# EAGLE design ArduBoard (EAGLE 6.1)
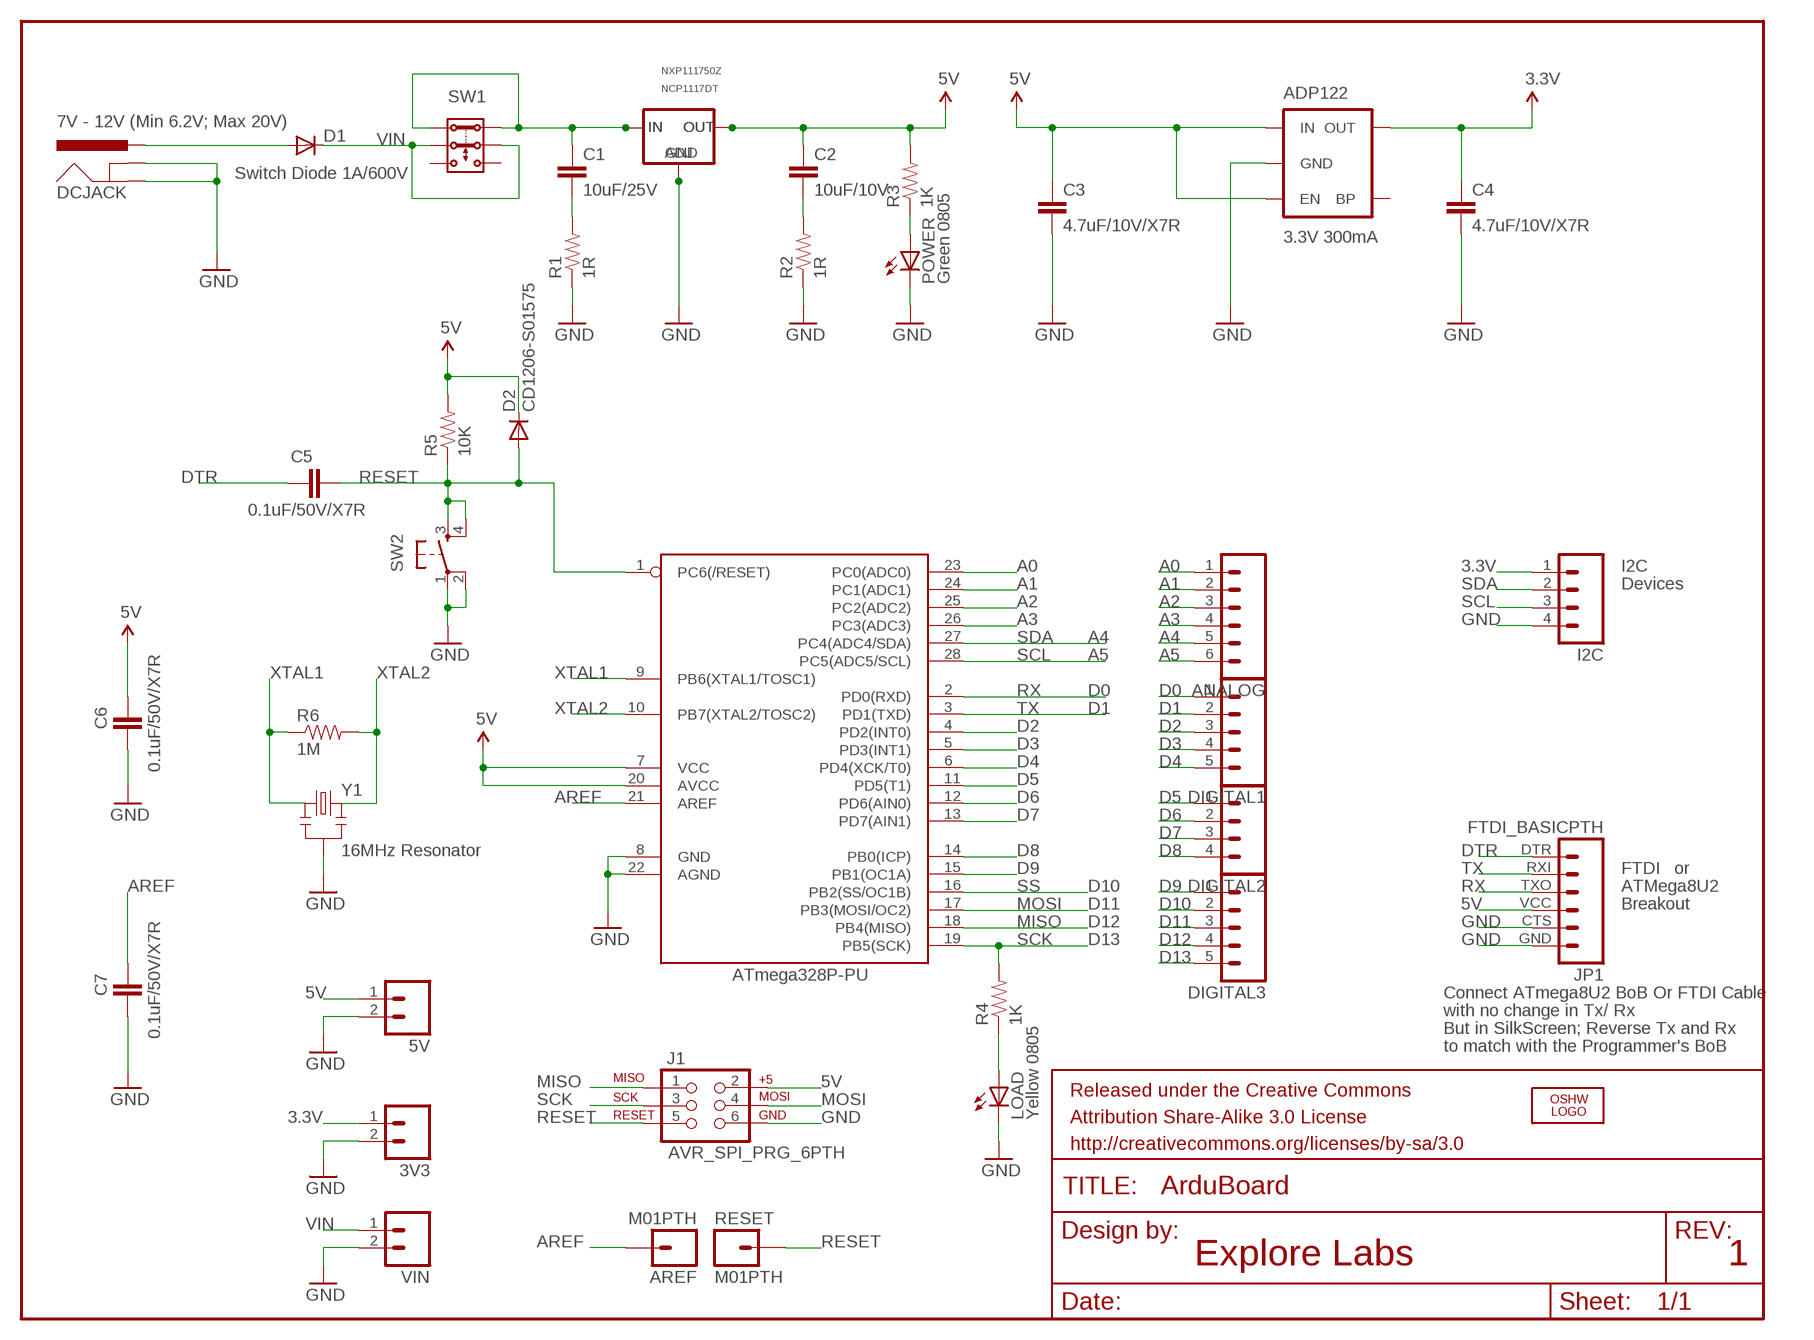
[diagram p0: schematic, sheet 1]

## Parts
3V3  M02PTH  [1X02]
5V  M02PTH  [1X02]
ADP122  3.3V 300mA  V_REG_LDOSMD  [SOT23-5]
ANALOG  M06SIP  [1X06]
AREF  M01PTH  [1X01]
ATMEGA328P-PU  AVR-MEGA8-PPTH  [DIL28-3]
C1  10uF/25V  CAP1206  [1206]
C2  10uF/10V  CAP1206  [1206]
C3  4.7uF/10V/X7R  CAP0805  [0805]
C4  4.7uF/10V/X7R  CAP0805  [0805]
C5  0.1uF/50V/X7R  CAP0805  [0805]
C6  0.1uF/50V/X7R  CAP0805  [0805]
C7  0.1uF/50V/X7R  CAP0805  [0805]
D1  Switch Diode 1A/600V  DIODE-DO-214AC  [DO-214AC]
D2  CD1206-S01575  DIODE-MINIMELF  [MINIMELF]
DCJACK  POWER_JACKPTH  [POWER_JACK_PTH]
DIGITAL1  M05PTH  [1X05]
DIGITAL2  M04PTH  [1X04]
DIGITAL3  M05PTH  [1X05]
I2C  M04PTH  [1X04]
IC1  V_REG_MIC2920NXPNX1117C50Z  [SOT223]
J1  AVR_SPI_PRG_6PTH  [2X3]
JP1  FTDI_BASICPTH  [FTDI_BASIC]
LOAD  Yellow 0805  LEDCHIP-LED0805  [CHIP-LED0805]
LOGO1  OSHW_LOGO_FILLX0150-NT  [OSHW_FILLX150_NOTEXT]
POWER  Green 0805  LEDCHIPLED_0805  [CHIPLED_0805]
R1  1R  RESISTOR0603-RES  [0603-RES]
R2  1R  RESISTOR0603-RES  [0603-RES]
R3  1K  RESISTOR0603-RES  [0603-RES]
R4  1K  RESISTOR0603-RES  [0603-RES]
R5  10K  RESISTOR0603-RES  [0603-RES]
R6  1M  RESISTOR0805-RES  [0805]
RESET  M01PTH  [1X01]
SW1  DPDTELEMENT14  [MS]
SW2  TAC_SWITCHPTH  [TACTILE-PTH]
U1  V_REG_317DPACK  [V-REG_DPACK]
VIN  M02PTH  [1X02]
Y1  16MHz Resonator  RESONATORSMD  [RESONATOR-SMD]

## Nets
3.3V: 3V3.1 ADP122.5(OUT) C4.1 I2C.1
5V [5v]: 5V.1 ADP122.1(IN) ADP122.3(EN) ATMEGA328P-PU.7(VCC) ATMEGA328P-PU.20(AVCC) C2.1 C3.1 C6.2 D2.C IC1.4(OUT) J1.2 JP1.VCC R3.2 R5.2 U1.4(OUT)
A0: ANALOG.1 ATMEGA328P-PU.23(PC0(ADC0))
A1: ANALOG.2 ATMEGA328P-PU.24(PC1(ADC1))
A2: ANALOG.3 ATMEGA328P-PU.25(PC2(ADC2))
A3: ANALOG.4 ATMEGA328P-PU.26(PC3(ADC3))
AREF: AREF.1 ATMEGA328P-PU.21(AREF) C7.2
D2: ATMEGA328P-PU.4(PD2(INT0)) DIGITAL1.3
D3: ATMEGA328P-PU.5(PD3(INT1)) DIGITAL1.4
D4: ATMEGA328P-PU.6(PD4(XCK/T0)) DIGITAL1.5
D5: ATMEGA328P-PU.11(PD5(T1)) DIGITAL2.1
D6: ATMEGA328P-PU.12(PD6(AIN0)) DIGITAL2.2
D7: ATMEGA328P-PU.13(PD7(AIN1)) DIGITAL2.3
D8: ATMEGA328P-PU.14(PB0(ICP)) DIGITAL2.4
D9: ATMEGA328P-PU.15(PB1(OC1A)) DIGITAL3.1
DTR: C5.1 JP1.DTR
GND [gnd]: 3V3.2 5V.2 ADP122.2(GND) ATMEGA328P-PU.8(GND) ATMEGA328P-PU.22(AGND) C3.2 C4.2 C6.1 C7.1 DCJACK.GND DCJACK.GNDBREAK I2C.4 IC1.1(GND) J1.6 JP1.CTS JP1.GND LOAD.C POWER.C R1.1 R2.1 SW2.1 SW2.2 U1.1(ADJ) VIN.2 Y1.2
MISO: ATMEGA328P-PU.18(PB4(MISO)) DIGITAL3.4 J1.1
MOSI: ATMEGA328P-PU.17(PB3(MOSI/OC2)) DIGITAL3.3 J1.4
N$1: C1.2 R1.2
N$2: C1.1 IC1.3(IN) SW1.P$1(1.2) SW1.P$2(1.1) U1.3(IN)
N$3: C2.2 R2.2
N$4: POWER.A R3.1
N$5: LOAD.A R4.1
N$6: D1.A DCJACK.PWR
RESET: ATMEGA328P-PU.1(PC6(/RESET)) C5.2 D2.A J1.5 R5.1 RESET.1 SW2.3 SW2.4
RX: ATMEGA328P-PU.2(PD0(RXD)) DIGITAL1.1 JP1.TXO
SCK: ATMEGA328P-PU.19(PB5(SCK)) DIGITAL3.5 J1.3 R4.2
SCL: ANALOG.6 ATMEGA328P-PU.28(PC5(ADC5/SCL)) I2C.3
SDA: ANALOG.5 ATMEGA328P-PU.27(PC4(ADC4/SDA)) I2C.2
SS: ATMEGA328P-PU.16(PB2(SS/OC1B)) DIGITAL3.2
TX: ATMEGA328P-PU.3(PD1(TXD)) DIGITAL1.2 JP1.RXI
VIN: D1.C SW1.P$3(2.1) SW1.P$4(2.2) VIN.1
XTAL1: ATMEGA328P-PU.9(PB6(XTAL1/TOSC1)) R6.1 Y1.1
XTAL2: ATMEGA328P-PU.10(PB7(XTAL2/TOSC2)) R6.2 Y1.3
Unconnected: ADP122.4(BP) SW1.P$5(3.1) SW1.P$6(3.2)

## Notes on the sheet
- NXP111750Z
- NCP1117DT
- 7V - 12V (Min 6.2V; Max 20V)
- I2C
- Devices
- A4 | A4
- A5 | A5
- D0 | D0
- D1 | D1
- FTDI | or
- D10 | ATMega8U2
- D11 | D10 | Breakout
- D12 | D11
- D13 | D12
- D13
- ATmega328P-PU
- Connect ATmega8U2 BoB Or FTDI Cable
- with no change in Tx/ Rx
- But in SilkScreen; Reverse Tx and Rx
- to match with the Programmer's BoB
- Explore Labs | 1

## Library data of the parts
3V3 5V VIN = SparkFun - copy Connectors:M02: Header 2 Standard 2-pin 0.1" header. Use with straight break away headers (SKU : PRT-00116), right angle break away headers (PRT-00553), swiss pins (PRT-00743), machine pins (PRT-00117), and female headers (PRT-00115). Molex polarized connector foot print use with SKU : PRT-08233 with associated crimp pins and housings.
ADP122 = SparkFun-PowerIC:V_REG_LDO: Voltage Regulator LDO Standard 150mA LDO voltage regulator in SOT-23 layout. Micrel part MIC5205. BP (by-pass) pin is used to lower output noise with 470pF cap.
ANALOG = SparkFun-Connectors:M06: Header 6 Standard 6-pin 0.1" header. Use with straight break away headers (SKU : PRT-00116), right angle break away headers (PRT-00553), swiss pins (PRT-00743), machine pins (PRT-00117), and female headers (PRT-00115). Molex polarized connector foot print use with SKU : PRT-08094 with associated crimp pins and housings. NOTES ON THE VARIANTS LOCK and LOCK_LONGPADS... This footprint was designed to help hold the alignment of a through-hole component (i.e. 6-pin header) while soldering it into place. You may notice that each hole has been shifted either up or down by 0.005 of an inch from it's more standard position (which is a perfectly straight line). This slight alteration caused the pins (the squares in the middle) to touch the edges of the holes. Because they are alternating, it causes a "brace" to hold the component in place. 0.005 has proven to be the perfect amount of "off-center" position when using our standard breakaway headers. Although looks a little odd when you look at the bare footprint, once you have a header in there, the alteration is very hard to notice. Also, if you push a header all the way into place, it is covered up entirely on the bottom side. This idea of altering the position of holes to aid alignment will be further integrated into the Sparkfun Library for other footprints. It can help hold any component with 3 or more connection pins.
AREF RESET = SparkFun-Connectors:M01: Header 1 Standard 1-pin 0.1" header. Use with straight break away headers (SKU : PRT-00116), right angle break away headers (PRT-00553), swiss pins (PRT-00743), machine pins (PRT-00117), and female headers (PRT-00115).
ATMEGA328P-PU = SparkFun-DigitalIC:AVR-MEGA8-P: MICROCONTROLLER 8 Kbytes FLASH 1 kbytes SRAM 512 bytes EEPROM USART 4-channel 10 bit ADC 2-channel 8 bit ADC
C1-C7 = SparkFun-Passives:CAP: Capacitor Standard 0603 ceramic capacitor, and 0.1" leaded capacitor.
D1 D2 = diode:DIODE-: DIODE
DCJACK = SparkFun-Connectors:POWER_JACK: Power Jack This is the standard 5.5mm barrel jack for power. The PTH is the most common, proven, reliable, footprint. All others are experimental. The Slot footprint only works if the mill layer is transmitted to the PCB fab house so be warned. Spark Fun Electronics SKU : PRT-00119. Mating wall wart : TOL-00298 (and others)
DIGITAL1 DIGITAL3 = SparkFun-Connectors:M05: Header 5 Standard 5-pin 0.1" header. Use with straight break away headers (SKU : PRT-00116), right angle break away headers (PRT-00553), swiss pins (PRT-00743), machine pins (PRT-00117), and female headers (PRT-00115). Molex polarized connector foot print use with SKU : PRT-08230 with associated crimp pins and housings.
DIGITAL2 = SparkFun - copy Connectors:M04: Header 4 Standard 4-pin 0.1" header. Use with straight break away headers (SKU : PRT-00116), right angle break away headers (PRT-00553), swiss pins (PRT-00743), machine pins (PRT-00117), and female headers (PRT-00115). Molex polarized connector foot print use with SKU : PRT-08231 with associated crimp pins and housings. 1MM SMD Version SKU: PRT-10208
I2C = SparkFun-Connectors:M04: Header 4 Standard 4-pin 0.1" header. Use with straight break away headers (SKU : PRT-00116), right angle break away headers (PRT-00553), swiss pins (PRT-00743), machine pins (PRT-00117), and female headers (PRT-00115). Molex polarized connector foot print use with SKU : PRT-08231 with associated crimp pins and housings. 1MM SMD Version SKU: PRT-10208
IC1 = copy:V_REG_MIC2920: NXP's NX1117C50Z 5V LDO 800mA 1% SOT223 Pins 2 and 4 are Output Pins. Pin 2 should be left connected to the Pad only. Pin 4 will provide Thermal Dissipation as well as Output to the rest of the Circuit. Datasheet - http://www.nxp.com/documents/data_sheet/NX1117C_NX1117CE_SER.pdf; NXP: NX1117C50Z
J1 = SparkFun-Connectors:AVR_SPI_PRG_6: AVR ISP 6 Pin This is the reduced ISP connector for AVR programming. Common on Arduino. This footprint will take up less PCB space and can be used with a 10-pin to 6-pin adapter such as SKU: BOB-08508
JP1 = SparkFun-Connectors:FTDI_BASIC: FTDI Basic header with labels
LOAD POWER = led:LED: LED OSRAM: - CHIPLED LG R971, LG N971, LY N971, LG Q971, LY Q971, LO R971, LY R971 LH N974, LH R974 LS Q976, LO Q976, LY Q976 LO Q996 - Hyper CHIPLED LW Q18S LB Q993, LB Q99A, LB R99A - SideLED LS A670, LO A670, LY A670, LG A670, LP A670 LB A673, LV A673, LT A673, LW A673 LH A674 LY A675 LS A676, LA A676, LO A676, LY A676, LW A676 LS A679, LY A679, LG A679 - Hyper Micro SIDELED® LS Y876, LA Y876, LO Y876, LY Y876 LT Y87S - SmartLED LW L88C, LW L88S LB L89C, LB L89S, LG L890 LS L89K, LO L89K, LY L89K LS L896, LA L896, LO L896, LY L896 - TOPLED LS T670, LO T670, LY T670, LG T670, LP T670 LSG T670, LSP T670, LSY T670, LOP T670, LYG T670 LG T671, LOG T671, LSG T671 LB T673, LV T673, LT T673, LW T673 LH T674 LS T676, LA T676, LO T676, LY T676, LB T676, LH T676, LSB T676, LW T676 LB T67C, LV T67C, LT T67C, LS T67K, LO T67K, LY T67K, LW E67C LS E67B, LA E67B, LO E67B, LY E67B, LB E67C, LV E67C, LT E67C LW T67C LS T679, LY T679, LG T679 LS T770, LO T770, LY T770, LG T770, LP T770 LB T773, LV T773, LT T773, LW T773 LH T774 LS E675, LA E675, LY E675, LS T675 LS T776, LA T776, LO T776, LY T776, LB T776 LHGB T686 LT T68C, LB T68C - Hyper Mini TOPLED® LB M676 - Mini TOPLED Santana® LG M470 LS M47K, LO M47K, LY M47K Source: http://www.osram.convergy.de LUXEON: - LUMILED® LXK2-PW12-R00, LXK2-PW12-S00, LXK2-PW14-U00, LXK2-PW14-V00 LXK2-PM12-R00, LXK2-PM12-S00, LXK2-PM14-U00 LXK2-PE12-Q00, LXK2-PE12-R00, LXK2-PE12-S00, LXK2-PE14-T00, LXK2-PE14-U00 LXK2-PB12-K00, LXK2-PB12-L00, LXK2-PB12-M00, LXK2-PB14-N00, LXK2-PB14-P00, LXK2-PB14-Q00 LXK2-PR12-L00, LXK2-PR12-M00, LXK2-PR14-Q00, LXK2-PR14-R00 LXK2-PD12-Q00, LXK2-PD12-R00, LXK2-PD12-S00 LXK2-PH12-R00, LXK2-PH12-S00 LXK2-PL12-P00, LXK2-PL12-Q00, LXK2-PL12-R00 Source: www.luxeon.com KINGBRIGHT: KA-3528ASYC Source: www.kingbright.com
LOGO1 = ohw-logo:OSHW_LOGO_FILL
R1-R6 = SparkFun-Passives:RESISTOR: Resistor Basic schematic elements and footprints for 0603, 1206, and PTH resistors.
SW1 = SparkFun - copy switch:DPDT
SW2 = SparkFun-Electromechanical:TAC_SWITCH: Momentary Switch Button commonly used for reset or general input. Spark Fun Electronics SKU : COM-00097
U1 = SparkFun-PowerIC:V_REG_317: Voltage Regulator Standard LM317 adjustable voltage regulator. AOI (Adjust Output Input). Google 'LM317 Calculator' for easy to use app to get the two resistor values needed. 240/720 for 5V output. 240/390 for 3.3V output. Spark Fun Electronics SKU : COM-00527
Y1 = SparkFun-FreqCtrl:RESONATOR: Resonator Small SMD resonator. This is the itty bitty 10/20MHz resonators with built in caps. CSTCE10M0G55 and CSTCE20M0V53. Footprint has been reviewed closely but hasn't been tested yet.

## Net classes
0 default: width 0.254 mm, drill 0.61 mm, clearance 0.254 mm
1 5v: width 0.254 mm, drill 0.61 mm, clearance 0.254 mm
2 gnd: width 0.254 mm, drill 0.61 mm, clearance 0.254 mm

## Board
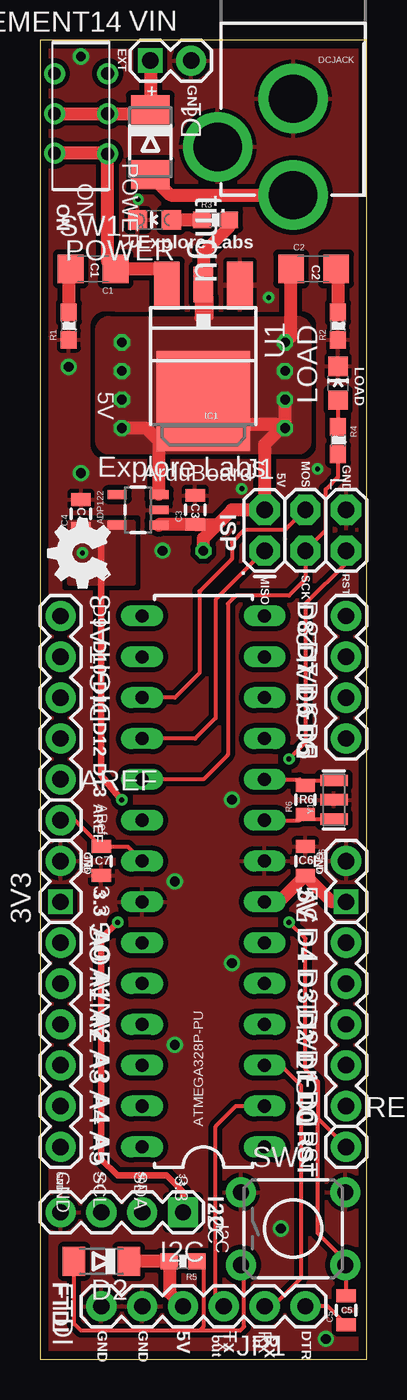
[diagram p1: board, top side]
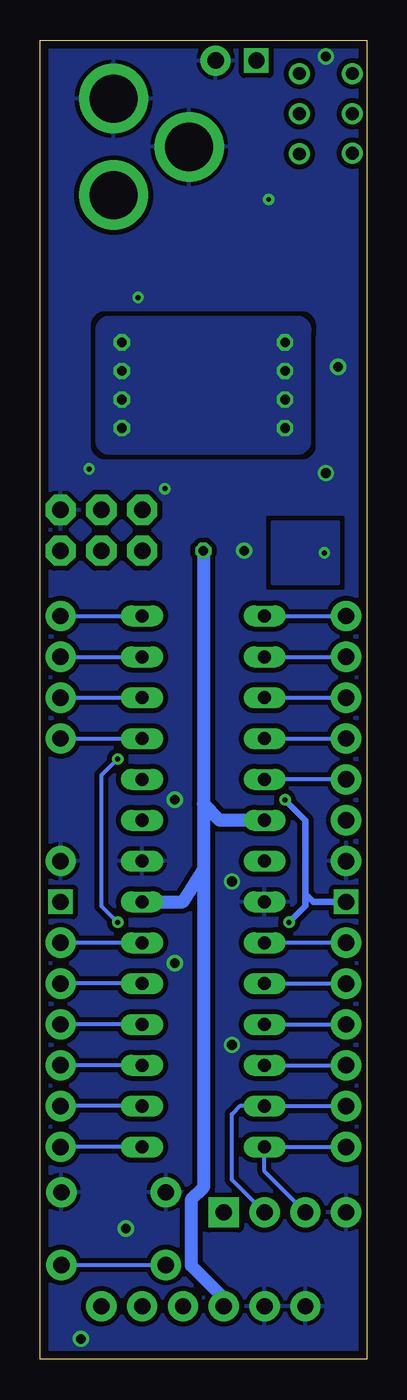
[diagram p2: board, bottom side, seen from below]

Size 20.32 x 82.04 mm. Coordinates in mm from the lower left corner, seen from the top.
Outline: 0,0 20.32,0 20.32,82.04 0,82.04 0,0
Copper layers (1*16): Top 0.035mm / dielectric 1.5mm / Bottom 0.035mm
Design rules: minimum track width 10mil, minimum drill 24mil, track to track 8mil, track to pad 8mil, pad to pad 8mil, via to via 8mil, smd to smd 8mil, copper to edge 20mil, drill to drill 8mil, minimum pad ring 10mil, minimum via ring 8mil, stop-mask expansion 4mil, vias tented up to drill 0mil, thermal gap 10mil

### Footprints (pad centres in the part's own frame; a part is rotated, then mirrored left to right if it is on the bottom)
1X02 = drill 1.016 pad 1.524 square: 1 0,0 | drill 1.016 pad 1.88: 2 2.54,0
SOT23-5 = smd 0.55 x 1.2: 1 -0.95,-1.3; 2 0,-1.3; 3 0.95,-1.3; 4 0.95,1.3; 5 -0.95,1.3
1X06 = drill 1.016 pad 1.88: 1 0,0; 2 2.54,0; 3 5.08,0; 4 7.62,0; 5 10.16,0; 6 12.7,0
1X01 = drill 1.016 pad 1.88: 1 0,0
DIL28-3 = drill 0.813 long: 1 -16.51,-3.81; 2 -13.97,-3.81; 3 -11.43,-3.81; 4 -8.89,-3.81; 5 -6.35,-3.81; 6 -3.81,-3.81; 7 -1.27,-3.81; 8 1.27,-3.81; 9 3.81,-3.81; 10 6.35,-3.81; 11 8.89,-3.81; 12 11.43,-3.81; 13 13.97,-3.81; 14 16.51,-3.81; 15 16.51,3.81; 16 13.97,3.81; 17 11.43,3.81; 18 8.89,3.81; 19 6.35,3.81; 20 3.81,3.81; 21 1.27,3.81; 22 -1.27,3.81; 23 -3.81,3.81; 24 -6.35,3.81; 25 -8.89,3.81; 26 -11.43,3.81; 27 -13.97,3.81; 28 -16.51,3.81
1206 = smd 1.6 x 1.8: 1 -1.4,0; 2 1.4,0
0805 = smd 0.8 x 1.2: 1 -0.9,0; 2 0.9,0
DO-214AC = smd 1.8 x 2.4: A 2.025,0; C -2.025,0
MINIMELF = smd 1.4 x 1.8: A 1.7,0; C -1.7,0
POWER_JACK_PTH = drill 2.997 pad 4.318: GND 0,7.7; GNDBREAK 4.7,10.7; PWR 0,13.7
1X05 = drill 1.016 pad 1.88: 1 0,0; 2 2.54,0; 3 5.08,0; 4 7.62,0; 5 10.16,0
1X04 = drill 1.016 pad 1.88: 1 0,0; 2 2.54,0; 3 5.08,0; 4 7.62,0
1X04' = drill 1.016 pad 1.88 square: 1 0,0 | drill 1.016 pad 1.88: 2 2.54,0; 3 5.08,0; 4 7.62,0
SOT223 = smd 1.219 x 2.235: 1 -2.3,-3.1; 2 0,-3.099; 3 2.311,-3.099 | smd 3.6 x 2.54: 4 0,3.3
2X3 = drill 1.016 pad 1.88 octagon: 1 0,0; 2 0,2.54; 3 2.54,0; 4 2.54,2.54; 5 5.08,0; 6 5.08,2.54
FTDI_BASIC = drill 1.016 pad 1.88: CTS 10.16,0; DTR 0,0; GND 12.7,0; RXI 2.54,0; TXO 5.08,0; VCC 7.62,0
CHIP-LED0805 = smd 1.2 x 1.2: A 0,-1.05; C 0,1.05
CHIPLED_0805 = smd 1.2 x 1.2: A 0,-1.05; C 0,1.05
0603-RES = smd 1.1 x 1: 1 -0.85,0; 2 0.85,0
MS = drill 0.8: P$1 -1.65,2.5; P$2 1.65,2.45; P$3 -1.65,0; P$4 1.65,0; P$5 -1.65,-2.5; P$6 1.65,-2.5
TACTILE-PTH = drill 1.016 pad 1.88: 1 -3.251,2.261; 2 3.251,2.261; 3 -3.251,-2.261; 4 3.251,-2.261
V-REG_DPACK = smd 1.6 x 3: 1 -2.28,-4.8; 3 2.28,-4.8 | smd 5.8 x 6.2: 4 0,2.38
RESONATOR-SMD = smd 0.7 x 1.7: 1 -1.2,0; 2 0,0; 3 1.2,0

### Placement (x,y rotation side)
3V3  1.27,28.45 90 top
5V  19.05,28.45 90 top
ADP122  6.1,52.83 90 top
ANALOG  1.27,25.91 270 top
AREF  1.27,33.53 0 top
ATMEGA328P-PU  10.16,29.72 90 top
C1  3.3,67.82 180 top
C2  17.02,67.82 0 top
C3  9.65,52.83 90 top
C4  2.54,52.58 90 top
C5  19.05,3.05 90 top
C6  16.51,30.99 270 top
C7  3.81,30.99 90 top
D1  6.86,75.69 270 top
D2  3.81,6.1 180 top
DCJACK  15.75,86.11 180 top
DIGITAL1  19.05,15.75 90 top
DIGITAL2  19.05,38.61 90 top
DIGITAL3  1.27,46.23 270 top
I2C  [1X04']  8.89,9.14 180 top
IC1  10.16,63.75 180 top
J1  13.97,50.29 0 top
JP1  16.51,3.3 180 top
LOAD  18.54,60.71 0 top
LOGO1  4.32,48.01 90 top
POWER  7.11,70.87 90 top
R1  1.78,64.26 90 top
R2  18.54,64.26 90 top
R3  10.92,70.87 0 top
R4  18.54,57.15 270 top
R5  8.89,6.1 180 top
R6  16.51,34.8 90 top
RESET  19.05,13.21 0 top
SW1  2.54,77.47 180 top
SW2  15.75,8.13 0 top
U1  10.16,61.98 180 top
VIN  6.86,80.77 0 top
Y1  18.29,34.8 90 top

### Tracks (layer width: path | path; a pad name or v marks a point on that pad's centre or on a via)
3.3V  (via drill 0.3)
  Top 0.406: 2.77,51.93 3.81,50.9 3.81,36.32 v5.08,34.8 | v4.83,27.18 3.81,26.16 3.81,12.45 4.83,11.43 7.87,11.43 8.89,10.41 I2C.1
  Bottom 0.406: v5.08,34.8 3.81,33.53 3.81,28.96 | 3.81,28.96 3.81,28.19 v4.83,27.18 | 3.81,28.96 3.3,28.45 3V3.1
  other vias: 2.63,50.15
  pour Top (isolate 0.305, no thermals): 1.78,48.26 5.84,48.26 5.84,52.07 1.78,52.07
  pour Bottom (isolate 0.305): 1.78,48.26 5.84,48.26 5.84,52.07 1.78,52.07
5V  (via drill 0.6)
  Top 0.254: 10.16,64.77 9.91,65.02 9.91,65.79 | 10.41,64.77 10.41,66.04 10.67,66.04 10.67,64.77
  Top 0.61: 9.91,65.79 9.91,64.77
  Top 0.813: ADP122.1 7.45,51.93 C3.1 11.04,51.93 | ATMEGA328P-PU.7 14.87,28.45 C6.2 18.15,28.45 5V.1 | 11.04,51.93 11.94,52.83 J1.2 13.97,56.9 15.24,58.17 v15.24,59.69 | v5.08,57.91 6.6,57.91 7.4,57.12 ADP122.3 7.4,57.18 8.38,58.17 14.99,58.17 v15.24,57.91 | JP1.VCC 8.04,4.15 R5.2 D2.C | v15.24,63.25 15.62,63.62 C2.1 | v10.16,50.29 10.16,51.05 11.04,51.93 | 10.16,64.77 10.16,68.83 11.77,70.45 R3.2
  Bottom 0.813: ATMEGA328P-PU.7 11.43,28.45 10.16,30.48 | v10.16,50.29 10.16,34.54 | 10.16,34.54 10.16,30.48 | 10.16,30.48 10.16,10.67 10.92,9.91 10.92,5.84 8.89,3.81 JP1.VCC | ATMEGA328P-PU.20 9.14,33.53 10.16,34.54
  other vias: 5.08,63.25 5.08,61.47 15.24,61.47 5.08,59.69
  pour Top (isolate 0.305, no thermals): 4.32,64.77 16,64.77 arc-90 16.76,64.01 16.76,57.15 arc-90 16,56.39 4.32,56.39 arc-90 3.56,57.15 3.56,64.01 arc-90
  pour Bottom (isolate 0.305): 4.32,64.77 16,64.77 arc-90 16.76,64.01 16.76,57.15 arc-90 16,56.39 4.32,56.39 arc-90 3.56,57.15 3.56,64.01 arc-90
A0
  Bottom 0.254: ANALOG.1 ATMEGA328P-PU.23
A1
  Bottom 0.254: ATMEGA328P-PU.24 ANALOG.2
A2
  Bottom 0.254: ATMEGA328P-PU.25 ANALOG.3
A3
  Bottom 0.254: ATMEGA328P-PU.26 ANALOG.4
AREF
  Top 0.254: AREF.1 2.17,33.53 C7.2 5.45,31.89 ATMEGA328P-PU.21
D2
  Bottom 0.254: ATMEGA328P-PU.4 DIGITAL1.3
D3
  Bottom 0.254: ATMEGA328P-PU.5 DIGITAL1.4
D4
  Bottom 0.254: ATMEGA328P-PU.6 DIGITAL1.5
D5
  Bottom 0.254: DIGITAL2.1 ATMEGA328P-PU.11
D6
  Bottom 0.254: DIGITAL2.2 ATMEGA328P-PU.12
D7
  Bottom 0.254: DIGITAL2.3 ATMEGA328P-PU.13
D8
  Bottom 0.254: DIGITAL2.4 ATMEGA328P-PU.14
D9
  Bottom 0.254: ATMEGA328P-PU.15 DIGITAL3.1
DTR
  Top 0.254: C5.1 17.9,3.3 JP1.DTR
GND  (via drill 0.3, 0.6)
  other vias: 2.54,55.12 7.62,50.29 8.38,29.72 11.94,24.64 14.99,8.13 17.78,1.27 6.1,72.14 1.78,61.72 14.22,66.04 2.54,81.03 12.56,54.14 17.27,55.37 11.94,34.8 8.38,19.56
  pour Top (isolate 0.305, rank 3): 0,82.04 20.32,82.04 20.32,0 0,0
  pour Bottom (isolate 0.305, rank 3): 0,82.04 20.32,82.04 20.32,0 0,0
MISO
  Top 0.254: J1.1 10.92,47.24 10.92,39.88 9.65,38.61 ATMEGA328P-PU.18
  Bottom 0.254: ATMEGA328P-PU.18 DIGITAL3.4
MOSI
  Top 0.254: J1.4 15.24,51.56 12.7,51.56 11.94,50.8 11.94,49.78 9.91,47.75 9.91,42.67 8.38,41.15 ATMEGA328P-PU.17
  Bottom 0.254: ATMEGA328P-PU.17 DIGITAL3.3
N$1
  Top 0.813: C1.2 1.78,67.69 R1.2
N$2
  Top 0.813: U1.3 7.86,67.05 IC1.3 7.87,67.17 7.87,67.82 C1.1 4.19,68.33 SW1.P$1 4.14,75.02 SW1.P$2
N$3
  Top 0.813: C2.2 18.54,67.69 R2.2
N$4
  Top 0.813: POWER.A R3.1
N$5
  Top 0.254: LOAD.A R4.1
N$6
  Top 0.813: D1.A 8.12,72.41 DCJACK.PWR
RESET  (via drill 0.3)
  Top 0.254: 17.27,14.99 17.27,7.85 19,6.12 SW2.4 19.05,5.82 C5.2 | J1.5 19.05,49.53 16.51,46.99 16.51,38.35 v15.49,37.34 | 17.27,14.99 17.27,17.27 16.51,18.03 16.51,26.16 v15.49,27.18 | 17.27,14.99 RESET.1 | SW2.3 12.7,5.66 12.7,2.03 12.45,1.78 9.91,1.78 | R5.1 10.16,5.68 10.16,2.03 9.91,1.78 | D2.A 2.11,2.21 2.54,1.78 9.14,1.78 9.91,1.78
  Bottom 0.254: ATMEGA328P-PU.1 RESET.1 | SW2.4 SW2.3 | v15.49,37.34 16.51,36.32 16.51,28.19 v15.49,27.18
RX
  Top 0.254: ATMEGA328P-PU.2 12.19,15.75 10.92,14.48 10.92,3.81 JP1.TXO
  Bottom 0.254: ATMEGA328P-PU.2 DIGITAL1.1
SCK
  Top 0.254: ATMEGA328P-PU.19 10.16,36.07 11.68,37.59 11.68,46.99 12.19,47.5 15.49,47.5 16.51,48.51 J1.3 17.78,51.56 17.78,54.1 18.54,54.86 R4.2
  Bottom 0.254: DIGITAL3.5 ATMEGA328P-PU.19
SCL
  Bottom 0.254: ANALOG.6 ATMEGA328P-PU.28 6.35,11.68 I2C.3
SDA
  Bottom 0.254: ANALOG.5 ATMEGA328P-PU.27 7.87,15.75 8.38,15.24 8.38,11.18 I2C.2
SS
  Bottom 0.254: ATMEGA328P-PU.16 DIGITAL3.2
TX
  Top 0.254: ATMEGA328P-PU.3 14.99,18.29 16.26,17.02 16.26,5.08 14.48,3.3 JP1.RXI
  Bottom 0.254: ATMEGA328P-PU.3 DIGITAL1.2
VIN
  Top 0.813: SW1.P$4 SW1.P$3 6.61,77.47 D1.C VIN.1
XTAL1
  Top 0.254: ATMEGA328P-PU.9 16.14,33.53 R6.1 16.81,33.6 Y1.1
XTAL2
  Top 0.254: Y1.3 16.81,36 R6.2 16.14,36.07 ATMEGA328P-PU.10

### Text on the board
tNames: POWER | ON | tingu | 5V | Explore Labs | L | ISP | . | D9 | D8 | D10 | D7 | D11 | D6 | D12 | D5 | D13 | ARef | GND | GND | 3.3 | 5V | A0 | D4 | A1 | D3 | A2 | D2 | A3 | D1 | A4 | D0 | A5 | RST | GND | SCL | SDA | 3.3 | I2C | I2C | FTDI | GND | GND | 5V | Tx | Rx | DTR
_tsilk: EXT | GND | + | ON | R3 | Explore Labs | C1 | C2 | R1 | R2 | LOAD | R4 | MOSI | GND | ArduBoard | 5V | C4 | C3 | ISP | . | MISO | SCK | RST | D9 | D8 | D10 | D7 | D11 | D6 | D12 | D5 | D13 | AREF | R6 | GND | GND | C7 | C6 | 3.3 | 5V | A0 | D4 | A1 | D3 | A2 | D2 | A3 | D1 | A4 | D0 | A5 | RST | GND | SCL | SDA | 3.3 | I2C | R5 | FTDI | C5 | GND | GND | 5V | out | Tx | in | Rx | DTR
_bsilk: EXT | Vin | GND | MOSI | GND | 5V | open | hardware | source | GND | 5V | . | MISO | SCK | RST | D9 | ArduBoard | D8 | D10 | D7 | D11 | D6 | D12 | D5 | D13 | AREF | GND | GND | 3.3 | 5V | A0 | D4 | A1 | D3 | A2 | D2 | Made in India | A3 | D1 | A4 | D0 | A5 | RST | I2C | GND | SCL | SDA | 3.3V | BLK | GRN | GND | GND | 5V | Tx | Rx | DTR